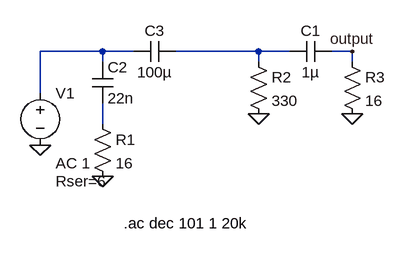
[diagram p0: schematic Draft2.asc]
Draft2.asc, the LTspice schematic file:
Version 4
SHEET 1 880 680
WIRE 112 64 16 64
WIRE 160 64 112 64
WIRE 352 64 224 64
WIRE 400 64 352 64
WIRE 496 64 464 64
WIRE 112 80 112 64
WIRE 352 80 352 64
WIRE 496 80 496 64
WIRE 16 128 16 64
WIRE 112 176 112 144
FLAG 16 208 0
FLAG 352 160 0
FLAG 496 160 0
FLAG 496 64 output
FLAG 112 256 0
SYMBOL voltage 16 112 R0
WINDOW 123 24 124 Left 2
WINDOW 39 24 152 Left 2
SYMATTR InstName V1
SYMATTR Value ""
SYMATTR Value2 AC 1
SYMATTR SpiceLine Rser=6
SYMBOL res 336 64 R0
SYMATTR InstName R2
SYMATTR Value 330
SYMBOL cap 224 48 R90
WINDOW 0 0 32 VBottom 2
WINDOW 3 32 32 VTop 2
SYMATTR InstName C3
SYMATTR Value 100µ
SYMBOL res 480 64 R0
SYMATTR InstName R3
SYMATTR Value 16
SYMBOL res 96 160 R0
SYMATTR InstName R1
SYMATTR Value 16
SYMBOL cap 464 48 R90
WINDOW 0 0 32 VBottom 2
WINDOW 3 32 32 VTop 2
SYMATTR InstName C1
SYMATTR Value 1µ
SYMBOL cap 96 80 R0
SYMATTR InstName C2
SYMATTR Value 22n
TEXT 144 328 Left 2 !.ac dec 101 1 20k

The netlist it stands for:
* Draft2.asc
V1 N001 0 AC 1 Rser=6
R2 N002 0 330
C3 N002 N001 100µ
R3 output 0 16
R1 N003 0 16
C1 output N002 1µ
C2 N001 N003 22n
.ac dec 101 1 20k
.backanno
.end